# EAGLE design single-supply-bridged (EAGLE 5.11)
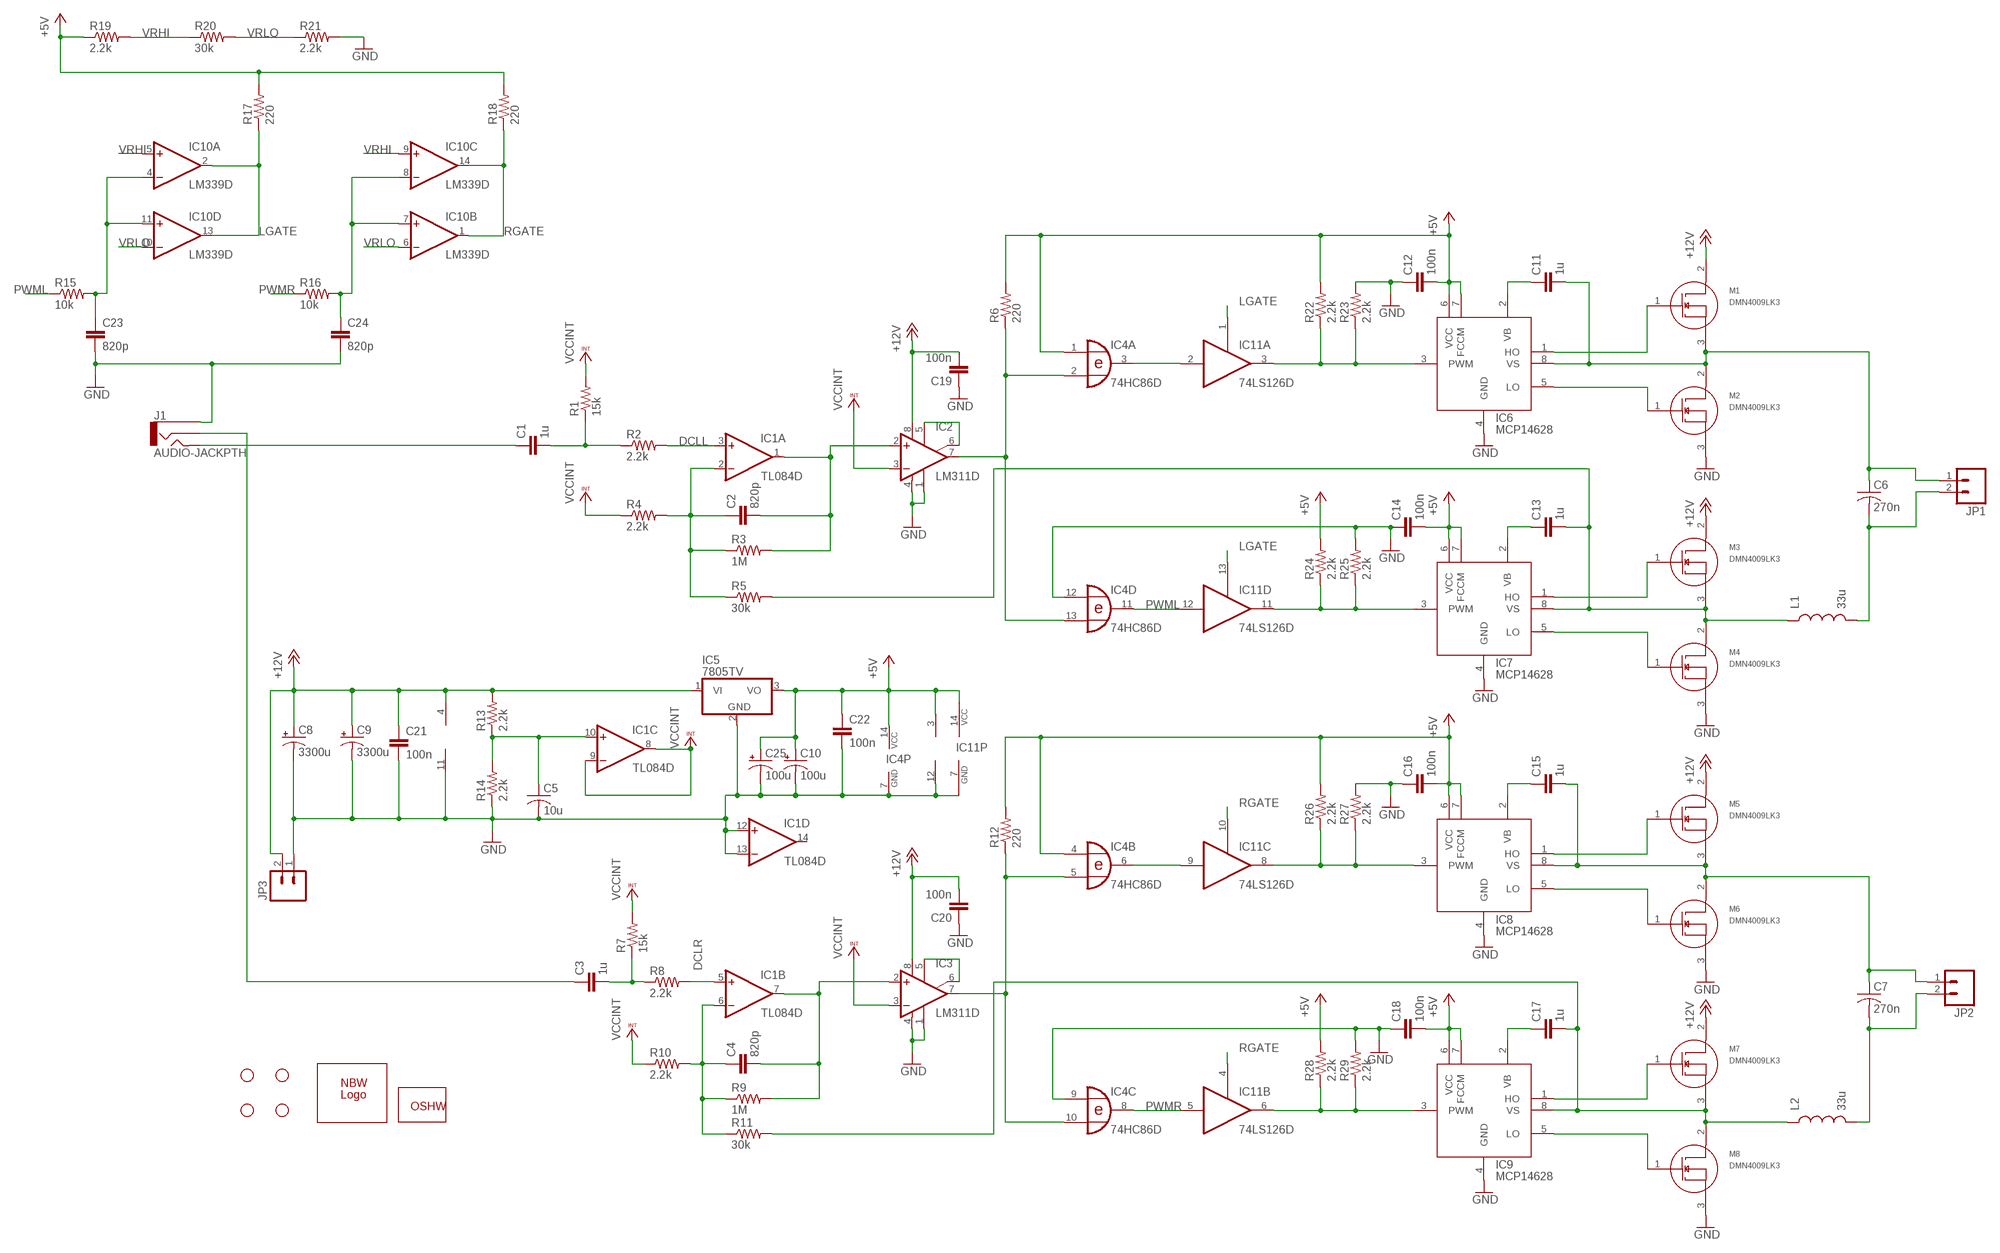
[diagram p0: schematic, sheet 1]

## Parts
C1  1u  CAP0603  [0603]
C2  820p  CAP0603  [0603]
C3  1u  CAP0603  [0603]
C4  820p  CAP0603  [0603]
C5  10u  C-USC0805  [C0805]
C6  270n  C-USC1210K  [C1210K]
C7  270n  C-USC1210K  [C1210K]
C8  3300u  CPOL-USE7.5-18  [E7,5-18]
C9  3300u  CPOL-USE7.5-18  [E7,5-18]
C10  100u  CPOL-USE2-5  [E2-5]
C11  1u  CAP0603  [0603]
C12  100n  CAP0603  [0603]
C13  1u  CAP0603  [0603]
C14  100n  CAP0603  [0603]
C15  1u  CAP0603  [0603]
C16  100n  CAP0603  [0603]
C17  1u  CAP0603  [0603]
C18  100n  CAP0603  [0603]
C19  100n  CAP0603  [0603]
C20  100n  CAP0603  [0603]
C21  100n  CAP0603  [0603]
C22  100n  CAP0603  [0603]
C23  820p  CAP0603  [0603]
C24  820p  CAP0603  [0603]
C25  100u  CPOL-USE2-5  [E2-5]
GOLD_ORB_SM1  OSHWLOGO_GOLD_ORB_SM  [OSHW2]
IC1  TL084D  [SO14]
IC2  LM311D  [SO08]
IC3  LM311D  [SO08]
IC4  74HC86D  [SO14]
IC5  7805TV  [TO220V]
IC6  MCP14628  [SO-08]
IC7  MCP14628  [SO-08]
IC8  MCP14628  [SO-08]
IC9  MCP14628  [SO-08]
IC10  LM339D  [SO14]
IC11  74LS126D  [SO14]
J1  AUDIO-JACKPTH  [AUDIO-JACK]
JP1  M023.5MM  [SCREWTERMINAL-3.5MM-2]
JP2  M023.5MM  [SCREWTERMINAL-3.5MM-2]
JP3  M023.5MM  [SCREWTERMINAL-3.5MM-2]
L1  33u  INDUCTORPWR  [CDRH125]
L2  33u  INDUCTORPWR  [CDRH125]
M1  DMN4009LK3  [TO252-3L]
M2  DMN4009LK3  [TO252-3L]
M3  DMN4009LK3  [TO252-3L]
M4  DMN4009LK3  [TO252-3L]
M5  DMN4009LK3  [TO252-3L]
M6  DMN4009LK3  [TO252-3L]
M7  DMN4009LK3  [TO252-3L]
M8  DMN4009LK3  [TO252-3L]
R1  15k  RESISTOR0603  [0603]
R2  2.2k  RESISTOR0603  [0603]
R3  1M  RESISTOR0603  [0603]
R4  2.2k  RESISTOR0603  [0603]
R5  30k  RESISTOR0603  [0603]
R6  220  RESISTOR0603  [0603]
R7  15k  RESISTOR0603  [0603]
R8  2.2k  RESISTOR0603  [0603]
R9  1M  RESISTOR0603  [0603]
R10  2.2k  RESISTOR0603  [0603]
R11  30k  RESISTOR0603  [0603]
R12  220  RESISTOR0603  [0603]
R13  2.2k  RESISTOR0603  [0603]
R14  2.2k  RESISTOR0603  [0603]
R15  10k  RESISTOR0603  [0603]
R16  10k  RESISTOR0603  [0603]
R17  220  RESISTOR0603  [0603]
R18  220  RESISTOR0603  [0603]
R19  2.2k  RESISTOR0603  [0603]
R20  30k  RESISTOR0603  [0603]
R21  2.2k  RESISTOR0603  [0603]
R22  2.2k  RESISTOR0603  [0603]
R23  2.2k  RESISTOR0603  [0603]
R24  2.2k  RESISTOR0603  [0603]
R25  2.2k  RESISTOR0603  [0603]
R26  2.2k  RESISTOR0603  [0603]
R27  2.2k  RESISTOR0603  [0603]
R28  2.2k  RESISTOR0603  [0603]
R29  2.2k  RESISTOR0603  [0603]
U$1  STAND-OFF  [STAND-OFF]
U$2  STAND-OFF  [STAND-OFF]
U$3  STAND-OFF  [STAND-OFF]
U$4  STAND-OFF  [STAND-OFF]
U$5  NBW_LOGOSMALL  [NBW_LOGO]

## Nets
+5V: C10.+ C12.2 C14.2 C16.2 C18.2 C22.1 C25.+ IC4.1(A:I0) IC4.4(B:I0) IC4.14(P:VCC) IC5.3(VO) IC6.6(VCC) IC6.7(FCCM) IC7.6(VCC) IC7.7(FCCM) IC8.6(VCC) IC8.7(FCCM) IC9.6(VCC) IC9.7(FCCM) IC10.3(P:V+) IC11.14(P:VCC) R6.2 R12.2 R17.2 R18.2 R19.1 R22.2 R24.2 R26.2 R28.2
+12V: C8.+ C9.+ C19.2 C20.2 C21.1 IC1.4(P:V+) IC2.8(V+) IC3.8(V+) IC5.1(VI) JP3.2 M1.2 M3.2 M5.2 M7.2 R13.2
DCLL: IC1.3(A:+IN) R2.2
DCLR: IC1.5(B:+IN) R8.2
GND: C5.2 C8.- C9.- C10.- C12.1 C14.1 C16.1 C18.1 C19.1 C20.1 C21.2 C22.2 C23.2 C24.2 C25.- IC1.11(P:V-) IC1.12(D:+IN) IC1.13(D:-IN) IC2.1(GND) IC2.4(V-) IC3.1(GND) IC3.4(V-) IC4.7(P:GND) IC4.9(C:I0) IC4.12(D:I0) IC5.2(GND) IC6.4(GND) IC7.4(GND) IC8.4(GND) IC9.4(GND) IC10.12(P:GND) IC11.7(P:GND) J1.1 JP3.1 M2.3 M4.3 M6.3 M8.3 R14.1 R21.2 R23.2 R25.2 R27.2 R29.2
LGATE: IC10.2(A:OUT) IC10.13(D:OUT) IC11.1(A:OE) IC11.13(D:OE) R17.1
N$1: C11.1 IC6.2(VB)
N$2: C1.2 R1.1 R2.1
N$3: C6.1 C11.2 IC6.8(VS) JP1.1 M1.3 M2.2
N$4: IC6.1(HO) M1.1
N$5: IC6.5(LO) M2.1
N$6: C13.2 IC7.8(VS) L1.1 M3.3 M4.2 R5.2
N$7: C13.1 IC7.2(VB)
N$8: IC7.1(HO) M3.1
N$9: IC7.5(LO) M4.1
N$11: IC4.3(A:O) IC11.2(A:I)
N$12: C1.1 J1.5
N$13: C15.1 IC8.2(VB)
N$14: IC2.5(ON) IC2.6(ON/STR)
N$15: IC8.1(HO) M5.1
N$16: IC8.5(LO) M6.1
N$17: IC6.3(PWM) IC11.3(A:O) R22.1 R23.1
N$18: C3.1 J1.2
N$19: C2.1 IC1.2(A:-IN) R3.1 R4.2 R5.1
N$20: C2.2 IC1.1(A:OUT) IC2.2(+IN) R3.2
N$21: C17.1 IC9.2(VB)
N$22: C17.2 IC9.8(VS) L2.1 M7.3 M8.2 R11.2
N$23: IC9.1(HO) M7.1
N$24: IC9.5(LO) M8.1
N$25: C7.2 JP2.2 L2.2
N$26: IC2.7(OUT) IC4.2(A:I1) IC4.13(D:I1) R6.1
N$27: C6.2 JP1.2 L1.2
N$28: C24.1 IC10.7(B:+IN) IC10.8(C:-IN) R16.2
N$29: C23.1 IC10.4(A:-IN) IC10.11(D:+IN) R15.2
N$30: IC3.5(ON) IC3.6(ON/STR)
N$31: IC7.3(PWM) IC11.11(D:O) R24.1 R25.1
N$32: IC3.7(OUT) IC4.5(B:I1) IC4.10(C:I1) R12.1
N$33: C3.2 R7.1 R8.1
N$34: IC8.3(PWM) IC11.8(C:O) R26.1 R27.1
N$35: C4.1 IC1.6(B:-IN) R9.1 R10.2 R11.1
N$36: C4.2 IC1.7(B:OUT) IC3.2(+IN) R9.2
N$37: C7.1 C15.2 IC8.8(VS) JP2.1 M5.3 M6.2
N$38: IC4.6(B:O) IC11.9(C:I)
N$39: IC9.3(PWM) IC11.6(B:O) R28.1 R29.1
N$42: C5.1 IC1.10(C:+IN) R13.1 R14.2
PWML: IC4.11(D:O) IC11.12(D:I) R15.1
PWMR: IC4.8(C:O) IC11.5(B:I) R16.1
RGATE: IC10.1(B:OUT) IC10.14(C:OUT) IC11.4(B:OE) IC11.10(C:OE) R18.1
VCCINT: IC1.8(C:OUT) IC1.9(C:-IN) IC2.3(-IN) IC3.3(-IN) R1.2 R4.1 R7.2 R10.1
VRHI: IC10.5(A:+IN) IC10.9(C:+IN) R19.2 R20.1
VRLO: IC10.6(B:-IN) IC10.10(D:-IN) R20.2 R21.1
Unconnected: IC1.14(D:OUT)

## Library data of the parts
C1-C4 C11-C24 = SparkFun:CAP: Capacitor Standard 0603 ceramic capacitor, and 0.1" leaded capacitor.
C5-C7 = rcl:C-US: CAPACITOR, American symbol
C8-C10 C25 = rcl:CPOL-US: POLARIZED CAPACITOR, American symbol
GOLD_ORB_SM1 = NBitWonder:OSHWLOGO: These are Open-Source Hardware logos.
IC1 = linear:TL084: OP AMP
IC2 IC3 = linear:LM311: COMPARATOR
IC4 = 74xx-eu:74*86: Quad 2-input EXCLUSIVE-OR (XOR) gate
IC5 = linear:78*: Positive VOLTAGE REGULATOR Source: http://cache.national.com/ds/LM/LM78L05.pdf http://www.fairchildsemi.com/ds/LM/LM7805.pdf
IC6-IC9 = NBitWonder:MCP14628
IC10 = linear:LM339: Low Power Low Offset Voltage Quad Comparators with open collector; LM139/LM239/LM339/LM2901/LM3302
IC11 = 74xx-us:74*126: Quad bus BUFFER, 3-state
J1 = SparkFun:AUDIO-JACK: 3.5mm Audio Jack Simple 3.5mm common PCB mount audio jack. SKU: PRT-08032
JP1-JP3 = SparkFun:M02: Header 2 Standard 2-pin 0.1" header. Use with straight break away headers (SKU : PRT-00116), right angle break away headers (PRT-00553), swiss pins (PRT-00743), machine pins (PRT-00117), and female headers (PRT-00115). Molex polarized connector foot print use with SKU : PRT-08233 with associated crimp pins and housings.
L1 L2 = SparkFun:INDUCTOR: Inductors Basic Inductor/Choke - 0603 and 1206. Footprints are not proven and vary greatly between part numbers.
M1-M8 = NBitWonder:DMN4009LK3
R1-R29 = SparkFun:RESISTOR: Resistor Basic schematic elements and footprints for 0603, 1206, and PTH 1/10th watt (small) resistors.
U$1-U$4 = SparkFun:STAND-OFF: Stand Off This is the mechanical footprint for a #4 phillips button head screw. Use the keepout ring to avoid running the screw head into surrounding components. SKU : PRT-00447
U$5 = NBitWonder:NBW_LOGO

## Board
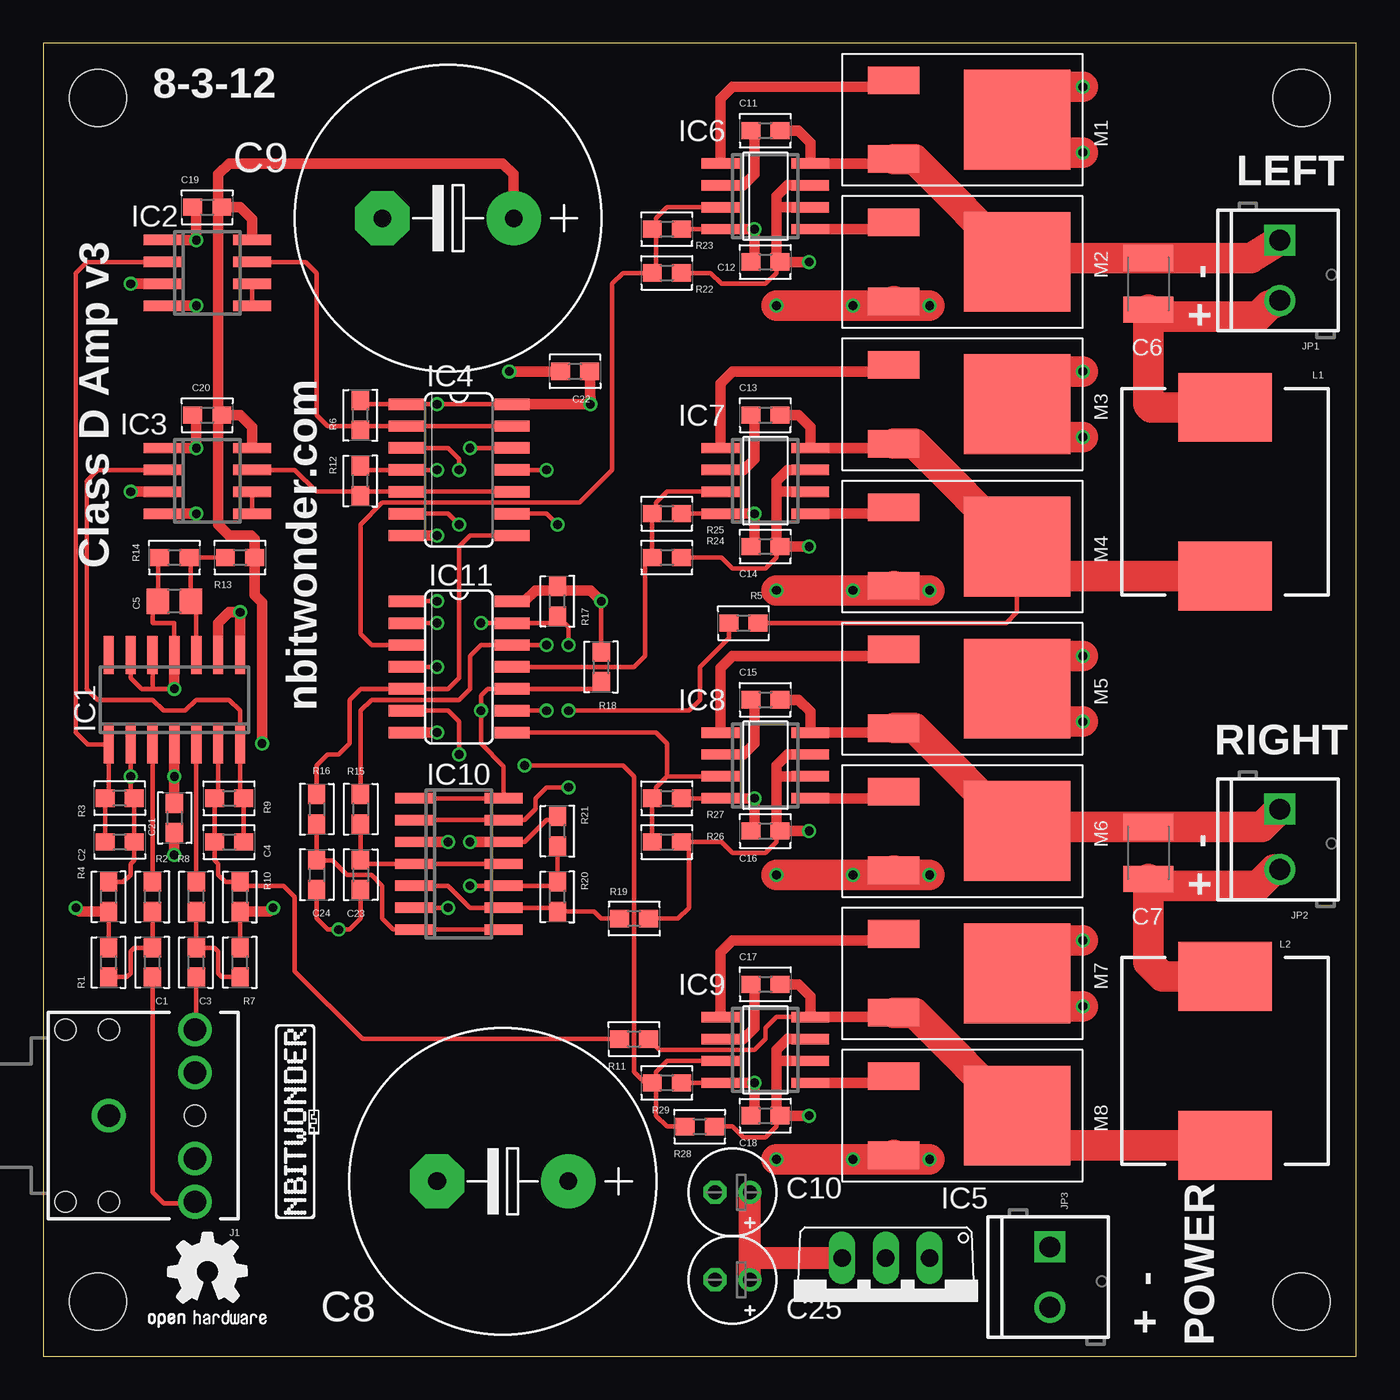
[diagram p1: board, top side]
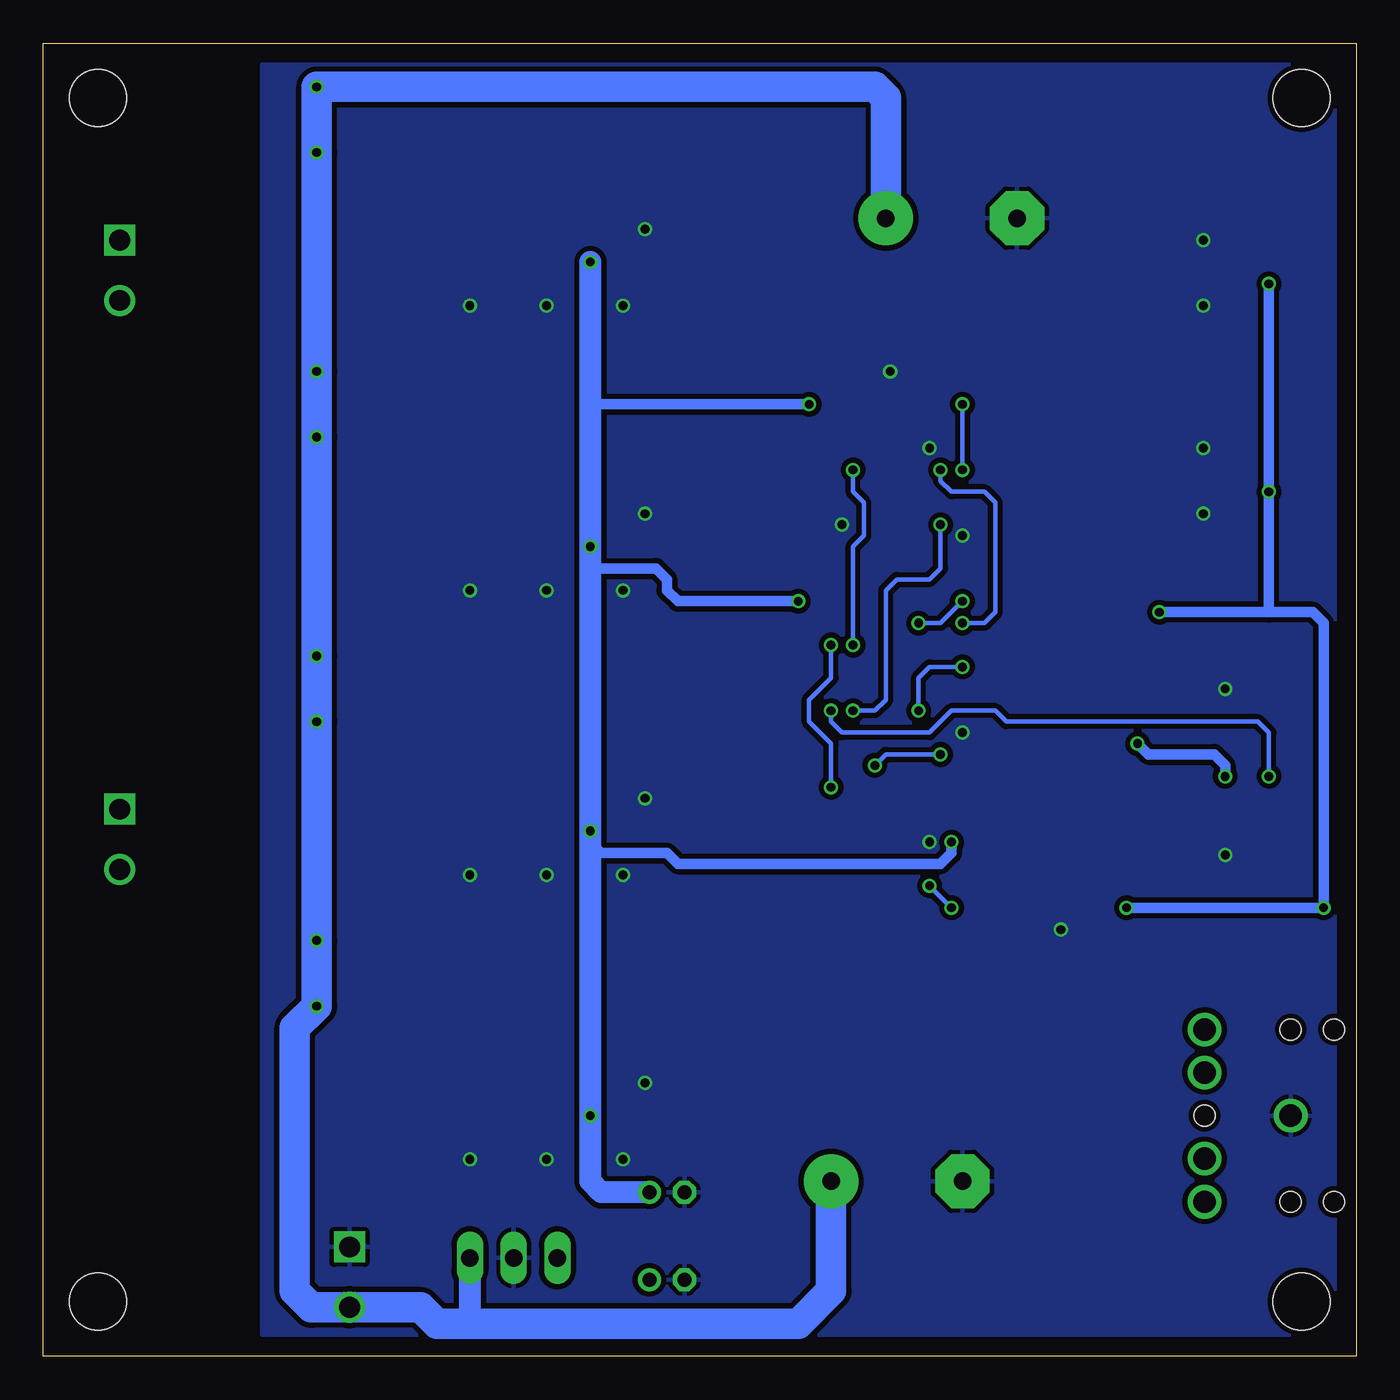
[diagram p2: board, bottom side, seen from below]

Size 76.2 x 76.2 mm. Coordinates in mm from the lower left corner, seen from the top.
Outline: 0,0 76.2,0 76.2,76.2 0,76.2 0,0
Copper layers (1*16): Top 0.035mm / dielectric 1.5mm / Bottom 0.035mm
Design rules: minimum track width 6mil, minimum drill 12mil, track to track 6mil, track to pad 6mil, pad to pad 6mil, via to via 6mil, smd to smd 0mil, copper to edge 10mil, drill to drill 10mil, minimum pad ring 10mil, minimum via ring 6mil, stop-mask expansion 2mil, vias tented up to drill 100mil, thermal gap 10mil

### Footprints (pad centres in the part's own frame; a part is rotated, then mirrored left to right if it is on the bottom)
0603 = smd 1.1 x 1: 1 -0.85,0; 2 0.85,0
C0805 = smd 1.3 x 1.5: 1 -0.95,0; 2 0.95,0
C1210K = smd 1.5 x 2.9: 1 -1.5,0; 2 1.5,0
E7,5-18 = drill 1.016 pad 3.15: + -3.81,0 | drill 1.016 pad 3.15 octagon: - 3.81,0
E2-5 = drill 0.813 pad 1.27: + -1.016,0 | drill 0.813 pad 1.27 octagon: - 1.016,0
SO14 = smd 0.6 x 2.2: 1 -3.81,-2.6; 2 -2.54,-2.6; 3 -1.27,-2.6; 4 0,-2.6; 5 1.27,-2.6; 6 2.54,-2.6; 7 3.81,-2.6; 8 3.81,2.6; 9 2.54,2.6; 10 1.27,2.6; 11 0,2.6; 12 -1.27,2.6; 13 -2.54,2.6; 14 -3.81,2.6
SO08 = smd 0.6 x 2.2: 1 -1.905,-2.6; 2 -0.635,-2.6; 3 0.635,-2.6; 4 1.905,-2.6; 5 1.905,2.6; 6 0.635,2.6; 7 -0.635,2.6; 8 -1.905,2.6
SO14' = smd 0.66 x 2.032: 1 -3.81,-3.073; 2 -2.54,-3.073; 3 -1.27,-3.073; 4 0,-3.073; 5 1.27,-3.073; 6 2.54,-3.073; 7 3.81,-3.073; 8 3.81,3.073; 9 2.54,3.073; 10 1.27,3.073; 11 0,3.073; 12 -1.27,3.073; 13 -2.54,3.073; 14 -3.81,3.073
TO220V = drill 1.016 long: 1 -2.54,-2.54; 2 0,-2.54; 3 2.54,-2.54
SO-08 = smd 0.6 x 2.2: 1 -1.905,-2.6; 2 -0.635,-2.6; 3 0.635,-2.6; 4 1.905,-2.6; 5 1.905,2.6; 6 0.635,2.6; 7 -0.635,2.6; 8 -1.905,2.6
AUDIO-JACK = drill 1.3: 1 0,0; 2 5,5; 3 5,2.5; 4 5,-2.5; 5 5,-5 | hole 1.2: 0,5; -2.5,5; -2.5,-5; 0,-5; 5,0
SCREWTERMINAL-3.5MM-2 = drill 1.2 square: 1 0,0 | drill 1.2: 2 3.5,0
CDRH125 = smd 5.4 x 4: 1 0,4.9; 2 0,-4.9
TO252-3L = smd 2.997 x 1.6: 1 7.163,-2.286; 3 7.163,2.286 | smd 6.198 x 5.791: 2 0,0
STAND-OFF = hole 3.302: 0,0

### Placement (x,y rotation side)
C1  6.35,22.86 90 top
C2  4.45,29.84 180 top
C3  8.89,22.86 90 top
C4  10.79,29.84 0 top
C5  7.62,43.81 180 top
C6  64.14,62.23 270 top
C7  64.14,29.21 270 top
C8  26.67,10.16 180 top
C9  23.5,66.04 180 top
C10  40.01,9.53 180 top
C11  41.91,71.12 0 top
C12  41.91,63.5 0 top
C13  41.91,54.61 0 top
C14  41.91,46.99 0 top
C15  41.91,38.1 0 top
C16  41.91,30.48 0 top
C17  41.91,21.59 0 top
C18  41.91,13.97 0 top
C19  9.53,66.67 0 top
C20  9.53,54.61 0 top
C21  7.62,31.24 270 top
C22  30.86,57.15 180 top
C23  18.41,27.94 270 top
C24  15.88,27.94 270 top
C25  40.01,4.45 180 top
GOLD_ORB_SM1  5.71,0.64 0 top
IC1  7.62,38.1 0 top
IC2  9.53,62.87 270 top
IC3  9.53,50.8 270 top
IC4  74HC86D  [SO14']  24.13,51.44 270 top
IC5  48.9,3.17 180 top
IC6  41.91,67.31 270 top
IC7  41.91,50.8 270 top
IC8  41.91,34.29 270 top
IC9  41.91,17.78 270 top
IC10  24.13,28.57 270 top
IC11  74LS126D  [SO14']  24.13,40.01 270 top
J1  3.81,13.97 0 top
JP1  71.75,64.77 270 top
JP2  71.75,31.75 270 top
JP3  58.42,6.35 270 top
L1  68.58,50.16 180 top
L2  68.58,17.14 180 top
M1  56.52,71.75 180 top
M2  56.52,63.5 180 top
M3  56.52,55.24 180 top
M4  56.52,46.99 180 top
M5  56.52,38.73 180 top
M6  56.52,30.48 180 top
M7  56.52,22.23 180 top
M8  56.52,13.97 180 top
R1  3.81,22.86 90 top
R2  6.35,26.67 90 top
R3  4.45,32.38 180 top
R4  3.81,26.67 90 top
R5  40.64,42.55 0 top
R6  18.41,54.61 90 top
R7  11.43,22.86 90 top
R8  8.89,26.67 90 top
R9  10.79,32.38 0 top
R10  11.43,26.67 90 top
R11  34.29,18.41 0 top
R12  18.41,50.8 90 top
R13  11.43,46.35 0 top
R14  7.62,46.35 0 top
R15  18.41,31.75 270 top
R16  15.88,31.75 270 top
R17  29.84,43.81 90 top
R18  32.38,40.01 90 top
R19  34.29,25.4 180 top
R20  29.84,26.67 90 top
R21  29.84,30.48 90 top
R22  36.2,62.87 0 top
R23  36.2,65.41 0 top
R24  36.2,46.35 0 top
R25  36.2,48.9 0 top
R26  36.2,29.84 0 top
R27  36.2,32.38 0 top
R28  38.1,13.34 0 top
R29  36.2,15.88 0 top
U$1  3.17,3.17 0 top
U$2  3.17,73.03 0 top
U$3  73.03,3.17 0 top
U$4  73.03,73.03 0 top
U$5  16.51,7.62 90 top

### Tracks (layer width: path | path; a pad name or v marks a point on that pad's centre or on a via)
+5V  (via drill 0.51)
  Top 0.254: IC4.14 v22.86,55.24 IC4.1 18.63,55.24 R6.2 | R12.2 18.63,51.44 IC4.4 v22.86,51.44 | C16.2 42.55,30.27 42.55,29.84 41.91,29.21 40.01,29.21 39.37,29.84 R26.2 37.47,29.43 37.47,26.04 36.83,25.4 R19.1 | R24.2 39.37,46.35 40.01,45.72 41.91,45.72 42.55,46.35 42.55,46.77 C14.2 | R22.2 38.73,62.87 39.37,62.23 41.91,62.23 42.55,62.87 42.55,63.28 C12.2 | R28.2 40.01,13.34 40.64,12.7 41.91,12.7 42.55,13.34 42.55,13.76 C18.2 | v32.38,43.81 R18.2 | 30.06,44.45 R17.2
  Top 0.61: IC9.7 43.18,18.41 42.55,17.78 42.55,17.14 | 42.55,17.14 42.55,14.19 C18.2 v44.45,13.97 | 42.55,17.14 IC9.6 | IC8.7 43.18,34.92 42.55,34.29 42.55,33.66 | 42.55,33.66 42.55,30.7 C16.2 v44.45,30.48 | 42.55,33.66 IC8.6 | IC7.7 43.18,51.44 42.55,50.8 42.55,50.16 | 42.55,50.16 42.55,47.2 C14.2 v44.45,46.99 | 42.55,50.16 IC7.6 | IC6.7 43.18,67.94 42.55,67.31 42.55,66.67 | 42.55,66.67 42.55,63.72 C12.2 v44.45,63.5 | 42.55,66.67 IC6.6 | IC4.14 v31.75,55.24 C22.1 | v23.5,29.84 IC10.3 | IC11.14 27.94,43.81 28.57,44.45 29.63,44.45 R17.2 | 30.06,44.45 31.75,44.45 v32.38,43.81
  Top 1.27: C25.+ 41.02,5.71 | 41.02,5.71 C10.+ | 41.02,5.71 IC5.3
  Bottom 0.254: v22.86,55.24 v22.86,51.44
  Bottom 0.61: v23.5,29.84 23.5,29.21 24.13,28.57 39.37,28.57 40.01,29.21 43.81,29.21 44.45,29.84 | v32.38,43.81 39.37,43.81 40.01,44.45 40.01,45.09 40.64,45.72 44.45,45.72 | 44.45,55.24 v31.75,55.24
  Bottom 1.27: v44.45,63.5 44.45,55.24 v44.45,46.99 44.45,45.72 v44.45,30.48 44.45,29.84 v44.45,13.97 44.45,10.16 43.81,9.53 C10.+
+12V  (via drill 0.51)
  Top 0.254: C20.2 10.16,54.4
  Top 0.61: C21.1 v7.62,33.66 IC1.4 | IC2.8 12.12,65.98 11.43,66.67 C19.2 | IC3.8 12.12,53.91 11.43,54.61 C20.2 10.16,54.61 10.16,66.46 C19.2 | 10.16,54.4 10.16,48.26 10.79,47.62 12.06,47.62 12.28,47.41 R13.2 12.28,44.17 12.7,43.75 v12.7,35.56 | C9.+ 27.3,68.58 26.67,69.22 10.79,69.22 10.16,68.58 10.16,66.89 C19.2
  Top 1.778: v60.33,73.66 59.05,73.66 57.15,71.75 M1.2 58.42,69.85 v60.33,69.85 | v60.33,57.15 58.42,57.15 M3.2 58.42,53.34 v60.33,53.34 | v60.33,40.64 58.42,40.64 M5.2 58.42,36.83 v60.33,36.83 | v60.33,24.13 58.42,24.13 M7.2 58.42,20.32 v60.33,20.32
  Bottom 0.61: v7.62,33.66 7.62,34.29 8.26,34.92 12.06,34.92 v12.7,35.56
  Bottom 1.27: 51.44,1.91 IC5.1
  Bottom 1.778: C9.+ 27.3,73.03 27.94,73.66 v60.33,73.66 v60.33,69.85 v60.33,57.15 v60.33,53.34 v60.33,40.64 v60.33,36.83 v60.33,24.13 v60.33,20.32 61.59,19.05 61.59,3.81 60.63,2.85 JP3.2 54.28,2.85 53.34,1.91 51.44,1.91 32.38,1.91 30.48,3.81 C8.+
DCLL
  Top 0.254: R2.2 IC1.3
DCLR
  Top 0.254: R8.2 IC1.5
GND  (via drill 0.51)
  Top 0.254: IC1.13 5.08,39.37 5.71,38.73 6.35,38.73 | 6.35,38.73 v7.62,38.73 | 6.35,38.73 IC1.12 | v24.77,52.7 IC4.12 | 7.62,40.64 7.62,42.55 6.35,42.55 6.35,43.81 C5.2 6.67,46.28 6.74,46.35 6.74,46.34 6.77,46.32 | R29.2 IC9.4 | R27.2 IC8.4 | R23.2 IC6.4 | R25.2 IC7.4 | C24.2 15.88,25.4 16.51,24.77 v17.14,24.77 17.78,24.77 18.41,25.4 C23.2 | IC10.12 27.94,29.84 29.21,31.11 29.63,31.11 R21.2 | IC4.9 29.21,48.9 v29.84,48.26 | 6.78,46.35 6.86,46.28 6.86,46.23 6.77,46.32 | R14.1 6.77,46.32
  Top 0.61: C21.2 7.62,29.62 v7.61,29.1 | v7.62,38.73 7.62,40.64 IC1.11 | IC2.1 v8.89,64.77 8.89,66.46 C19.1 | IC2.4 v8.89,60.96 | IC3.1 v8.89,52.7 8.89,54.4 C20.1 | IC3.4 v8.89,48.9 | IC4.7 v22.86,47.62 | IC6.4 v41.27,65.41 41.27,63.72 C12.1 | IC7.4 v41.27,48.9 41.27,47.2 C14.1 | IC8.4 v41.27,32.38 41.27,30.7 C16.1 | IC9.4 v41.27,15.88 41.27,14.19 C18.1 | v27.05,57.15 C22.2 | IC11.7 v22.86,36.2 | v24.77,29.84 IC10.12
  Top 1.778: 49.1,27.94 v51.44,27.94 | v42.55,27.94 v46.99,27.94 49.1,27.94 | 49.1,27.94 M6.3 | v46.99,44.45 v51.44,44.45 | v42.55,44.45 v46.99,44.45 | v46.99,44.45 49.1,44.45 M4.3 | v46.99,60.96 v51.44,60.96 | v46.99,60.96 49.1,60.96 M2.3 | v46.99,11.43 v51.44,11.43 | v46.99,11.43 49.1,11.43 M8.3 | v42.55,11.43 v46.99,11.43 | v42.55,60.96 v46.99,60.96
  pour Bottom (isolate 0.305): 1.27,1.27 63.5,1.27 63.5,74.93 1.27,74.93
LGATE  (via drill 0.51)
  Top 0.254: IC10.2 IC10.13 27.94,31.11 28.57,31.75 28.57,32.38 29.21,33.02 v30.48,33.02 | v25.4,42.55 IC11.13 29.43,42.55 R17.1 30.48,42.33 v30.48,41.27 | v22.86,43.81 IC11.1
  Bottom 0.254: v25.4,42.55 24.13,42.55 v22.86,43.81 | v30.48,33.02 30.48,35.56 31.75,36.83 31.75,38.1 30.48,39.37 v30.48,41.27
N$1
  Top 0.61: IC6.2 40.64,67.94 41.27,68.58 41.27,70.91 C11.1
N$2
  Top 0.254: R2.1 C1.2 5.29,23.71 5.08,23.5 5.08,22.23 4.87,22.01 R1.1
N$3
  Top 0.61: M1.3 48.97,69.85 48.9,69.85 48.26,69.22 IC6.8 44.51,70.42 43.81,71.12 C11.2
  Top 1.778: M1.3 50.55,69.47 M2.2 56.74,63.73 C6.1 70.08,63.73 JP1.1
N$4
  Top 0.61: IC6.1 39.31,72.97 40.01,73.66 48.97,73.66 M1.1
N$5
  Top 0.61: IC6.5 48.97,65.41 M2.1
N$6
  Top 0.254: R5.2 55.88,42.55 56.52,43.18 M4.2
  Top 0.61: M3.3 49.1,52.7 IC7.8 44.51,53.91 43.81,54.61 C13.2
  Top 1.778: M3.3 50.55,52.96 M4.2 58.24,45.27 L1.1
N$7
  Top 0.61: IC7.2 40.64,51.44 41.27,52.07 41.27,54.4 C13.1
N$8
  Top 0.61: IC7.1 39.31,56.45 40.01,57.15 48.97,57.15 M3.1
N$9
  Top 0.61: IC7.5 48.97,48.9 M4.1
N$11  (via drill 0.51)
  Top 0.254: IC4.3 23.5,52.7 24.13,52.07 v24.13,51.44 | IC11.2 v22.86,42.55
  Bottom 0.254: v24.13,51.44 24.13,50.8 23.5,50.16 21.59,50.16 20.95,49.53 20.95,43.18 21.59,42.55 v22.86,42.55
N$12
  Top 0.254: C1.1 6.35,9.53 6.99,8.89 8.73,8.89 J1.5
N$13
  Top 0.61: IC8.2 40.64,34.92 41.27,35.56 41.27,37.88 C15.1
N$14
  Top 0.254: IC2.6 IC2.5
N$15
  Top 0.61: IC8.1 39.31,39.95 40.01,40.64 48.97,40.64 M5.1
N$16
  Top 0.61: IC8.5 48.97,32.38 M6.1
N$17
  Top 0.254: IC6.3 36.2,66.67 35.56,66.04 35.56,65.62 R23.1 35.56,65.19 35.56,63.08 R22.1 33.66,62.87 33.02,62.23 33.02,51.44 31.11,49.53 19.68,49.53 18.41,48.26 18.41,41.91 19.05,41.27 IC11.3
N$18
  Top 0.254: C3.1 8.89,19.05 J1.2
N$19  (via drill 0.51)
  Top 0.254: R4.2 4.66,27.52 5.08,27.94 5.08,28.57 5.29,28.79 C2.1 R3.1 5.08,32.6 v5.08,33.66 IC1.2 | R5.1 39.79,41.7 38.1,40.01 38.1,38.1 37.47,37.47 v30.48,37.47
  Bottom 0.254: v5.08,33.66 5.08,36.2 5.71,36.83 20.32,36.83 20.95,37.47 23.5,37.47 24.77,36.2 29.84,36.2 30.48,36.83 v30.48,37.47
N$20
  Top 0.254: C2.2 R3.2 3.81,32.6 IC1.1 2.6,35.5 1.91,36.2 1.91,62.87 2.54,63.5 IC2.2
N$21
  Top 0.61: IC9.2 40.64,18.41 41.27,19.05 41.27,21.38 C17.1
N$22
  Top 0.254: IC9.8 42.55,19.68 41.91,19.05 41.91,18.41 41.27,17.78 35.77,17.78 R11.2
  Top 0.61: M7.3 49.1,19.68 IC9.8 44.51,20.89 43.81,21.59 C17.2
  Top 1.778: M7.3 50.55,19.94 M8.2 58.24,12.24 L2.1
N$23
  Top 0.61: IC9.1 39.31,23.43 40.01,24.13 48.97,24.13 M7.1
N$24
  Top 0.61: IC9.5 48.97,15.88 M8.1
N$25
  Top 1.778: L2.2 64.95,22.05 64.14,22.86 C7.2 64.54,27.3 70.48,27.3 71.43,28.25 JP2.2
N$26
  Top 0.254: IC4.13 IC4.2 18.63,53.98 R6.1 18.2,53.98 16.51,53.98 15.88,54.61 15.88,62.87 15.24,63.5 IC2.7
N$27
  Top 1.778: JP1.2 71.12,60.96 70.48,60.33 64.54,60.33 C6.2 64.14,55.24 64.31,55.06 L1.2
N$28
  Top 0.254: R16.2 C24.1 16.8,28.79 17.65,27.94 19.05,27.94 19.68,27.3 19.68,25.4 20.32,24.77 IC10.7 IC10.8
N$29
  Top 0.254: 18.41,30.48 R15.2 C23.1 18.63,28.57 IC10.4 IC10.11
N$30
  Top 0.254: IC3.6 IC3.5
N$31
  Top 0.254: IC7.3 36.2,50.16 35.56,49.53 35.56,49.11 R25.1 R24.1 34.92,45.94 34.92,40.64 34.29,40.01 IC11.11
N$32
  Top 0.254: 18.63,50.16 IC4.5 IC4.10 | 18.63,50.16 R12.1 18.2,50.16 | IC3.7 14.61,51.44 15.88,50.16 18.63,50.16
N$33
  Top 0.254: R8.1 C3.2 9.95,23.71 10.16,23.5 10.16,22.23 10.38,22.01 R7.1
N$34
  Top 0.254: 36.2,33.66 IC8.3 | 36.2,33.66 35.56,33.02 35.56,32.6 R27.1 R26.1 | IC11.8 35.56,36.2 36.2,35.56 36.2,33.66
N$35
  Top 0.254: IC1.6 10.16,32.6 R9.1 C4.1 9.95,28.79 10.16,28.57 10.16,27.94 10.58,27.52 R10.2 11.64,27.3 13.97,27.3 14.61,26.67 14.61,22.35 18.54,18.41 R11.1
N$36
  Top 0.254: C4.2 R9.2 11.43,32.6 IC1.7 11.43,37.47 10.79,38.1 8.89,38.1 8.26,37.47 6.99,37.47 6.35,38.1 3.17,38.1 2.54,38.73 2.54,50.8 3.17,51.44 IC3.2
N$37
  Top 0.61: M5.3 49.1,36.2 IC8.8 44.51,37.41 43.81,38.1 C15.2
  Top 1.778: JP2.1 70.72,30.71 C7.1 56.74,30.71 M6.2 50.55,36.45 M5.3
N$38  (via drill 0.51)
  Top 0.254: IC11.9 v29.21,37.47 | IC4.6 23.5,48.9 v24.13,48.26
  Bottom 0.254: v24.13,48.26 24.13,45.72 24.77,45.09 26.67,45.09 27.3,44.45 27.3,38.1 27.94,37.47 v29.21,37.47
N$39  (via drill 0.51)
  Top 0.254: IC9.3 36.2,17.14 35.56,16.51 35.56,16.09 R29.1 | R28.1 36.2,13.34 35.56,13.97 35.56,15.66 R29.1 | IC11.6 23.5,37.47 24.13,36.83 v24.13,34.92 | v27.94,34.29 33.66,34.29 34.29,33.66 34.29,16.51 34.92,15.88 R29.1
  Bottom 0.254: v24.13,34.92 27.3,34.92 v27.94,34.29
N$42
  Top 0.254: IC1.10 8.89,43.6 C5.1 8.57,46.26 R14.2 R13.1
PWML  (via drill 0.51)
  Top 0.254: R15.1 18.41,37.47 19.05,38.1 24.13,38.1 24.77,38.73 24.77,40.64 25.4,41.27 IC11.12 v29.21,41.27 | v29.21,51.44 IC4.11
  Bottom 0.254: v29.21,41.27 29.21,46.99 28.57,47.62 28.57,49.53 29.21,50.16 v29.21,51.44
PWMR
  Top 0.254: R16.1 15.88,34.29 16.51,34.92 17.14,34.92 17.78,35.56 17.78,38.1 18.41,38.73 IC11.5 23.5,38.73 24.13,39.37 24.13,46.99 24.77,47.62 IC4.8
RGATE  (via drill 0.51)
  Top 0.254: IC10.1 IC10.14 26.73,34.23 25.4,35.56 v25.4,37.47 25.4,38.35 25.78,38.73 IC11.10 31.96,38.73 R18.1 | v22.86,40.01 IC11.4
  Bottom 0.254: v22.86,40.01 24.77,40.01 25.4,39.37 v25.4,37.47
VCCINT  (via drill 0.51)
  Top 0.254: R1.2 R4.1 | R10.1 R7.2
  Top 0.61: IC1.8 v11.43,43.18 10.79,43.18 10.16,42.55 IC1.9 | v5.08,62.23 IC2.3 | v5.08,50.16 IC3.3 | R4.1 2.12,25.82 v1.91,26.04 | R10.1 13.12,25.82 v13.34,26.04
  Bottom 0.61: v5.08,62.23 v5.08,50.16 5.08,43.18 | 5.08,43.18 v11.43,43.18 | v13.34,26.04 v1.91,26.04 1.91,42.55 2.54,43.18 5.08,43.18
VRHI
  Top 0.254: IC10.5 23.5,27.3 24.77,26.04 IC10.9 29.63,26.04 R20.1 31.96,25.82 32.38,25.4 R19.2
VRLO  (via drill 0.51)
  Top 0.254: R21.1 R20.2 29.63,27.3 IC10.10 v24.77,27.3 | IC10.6 v23.5,26.04
  Bottom 0.254: v23.5,26.04 v24.77,27.3

### Text on the board
tNames: 8-3-12 | LEFT | + - | Class D Amp v3 | nbitwonder.com | RIGHT | + - | + - | POWER